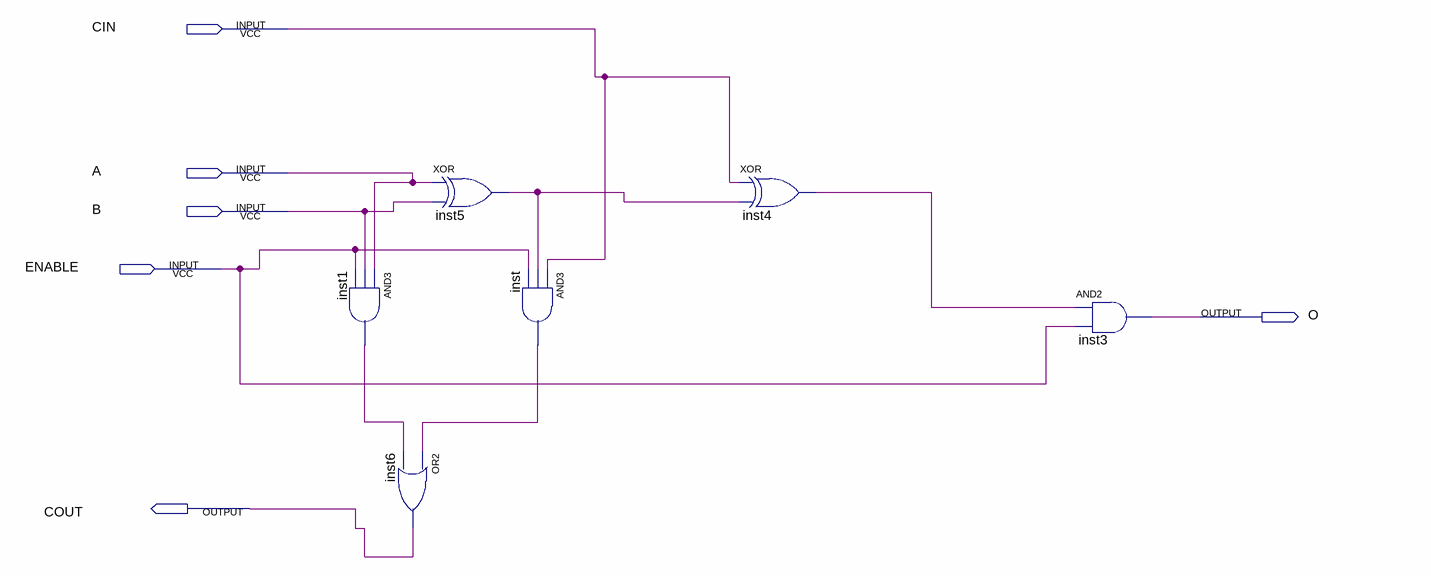
[diagram p0: schematic sheet]
// Quartus schematic FULL_ADDER_1bit.bdf as structural Verilog: 6 symbols, 6 pins
module FULL_ADDER_1bit (
  input  CIN,
  input  A,
  input  B,
  input  ENABLE,
  output O,
  output COUT
);

  wire inst1_out, inst4_out, inst5_out, inst_out;

  and inst1 (inst1_out, A, B, ENABLE);
  or inst6 (COUT, inst_out, inst1_out);
  xor inst5 (inst5_out, A, B);
  and inst (inst_out, CIN, inst5_out, ENABLE);
  xor inst4 (inst4_out, CIN, inst5_out);
  and inst3 (O, inst4_out, ENABLE);
endmodule
